# Altium schematic sheet namur_pi-dock.SchDoc
size Letter
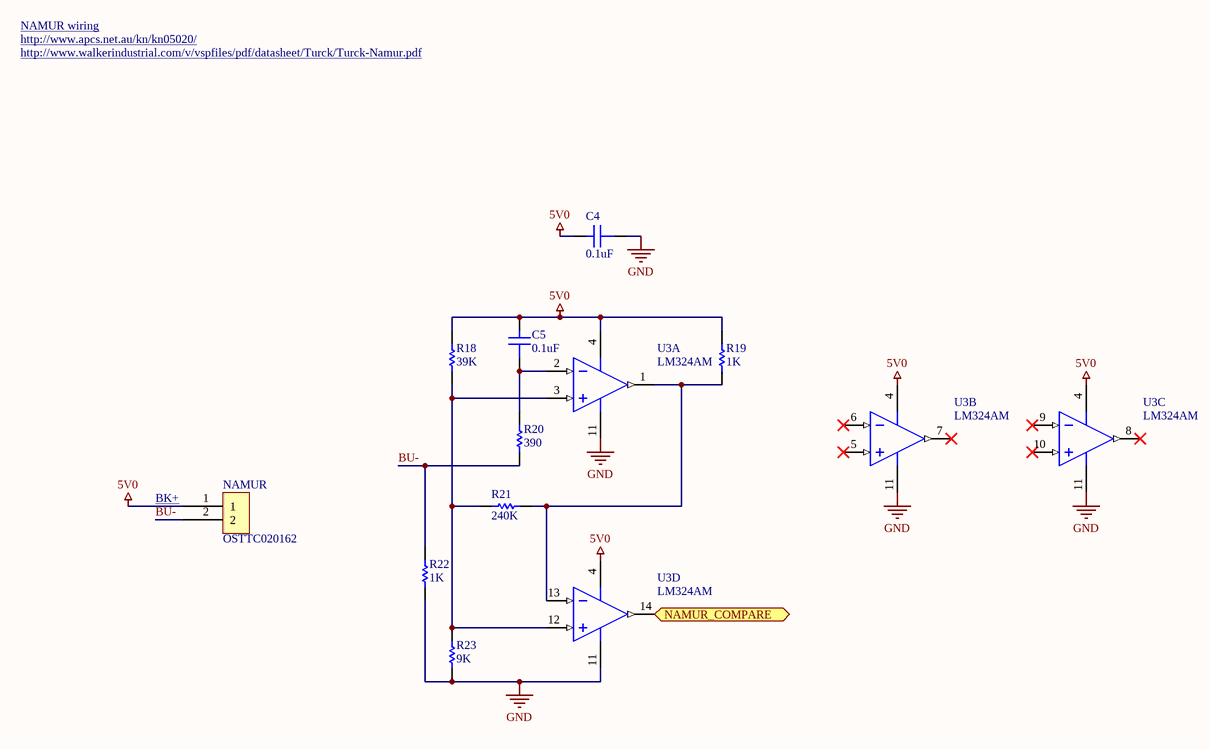
[diagram p0: namur_pi-dock.SchDoc]

## Parts
C4  0.1uF  [CAP_8085]
C5  0.1uF  [CAP_8085]
NAMUR  OSTTC020162  [DIP2_5MM_SCREWTERM]
R18  39K  [RES_8085]
R19  1K  [RES_8085]
R20  390  [RES_8085]
R21  240K  [RES_8085]
R22  1K  [RES_8085]
R23  9K  [RES_8085]
U3  LM324AM  [M14A_N]  (parts A,B,C,D of 4)

## Ports
NAMUR_COMPARE (out)

## Nets
5V0: C4.2 C5.2 NAMUR.1 R18.2 R19.2 U3.4(V+)
GND: C4.1 R22.2 R23.1 U3.11(GND)
BU-: NAMUR.2 R20.2 R22.1
NAMUR_COMPARE: U3.14(OUT4) ; port NAMUR_COMPARE
NetC5_1: C5.1 R20.1 U3.2(IN1-)
NetR18_1: R18.1 R21.1 R23.2 U3.3(IN1+) U3.12(IN4+)
NetR19_1: R19.1 R21.2 U3.1(OUT1) U3.13(IN4-)

Not connected (* = marked no-connect by the designer): U3 5(IN2+)* 6(IN2-)* 7(OUT2)* 8(OUT3)* 9(IN3-)* 10(IN3+)*

## Notes on the sheet
- NAMUR wiring
- http://www.apcs.net.au/kn/kn05020/
- http://www.walkerindustrial.com/v/vspfiles/pdf/datasheet/Turck/Turck-Namur.pdf
- (near NAMUR) BK+

## Library data of the parts
C4 C5 = CHIP-CAP: SMD Chip Capacitor; Value: 0.1uF
NAMUR = OSTTC020162: ON SHORE TERMINAL BLOCK 5MM VERT 2POS PCB; ComponentLink1URL: http://www.on-shore.com/sites/default/files/manuals/osttcxx0162.pdf; ComponentLink1Description: Datasheet; Supplier 1: Digi-Key; Supplier Part Number 1: ED2600-ND
R18-R23 = CHIP-RES: SMD Chip Resistor
  R18: Value: 39K
  R19 R22: Value: 1K
  R20: Value: 390
  R21: Value: 240K
  R23: Value: 9K
U3 = LM324AM: Low Power Quad Operational Amplifier, 14-pin Narrow SOIC; Manufacturer: National Semiconductor; PackageTopMarking: NSUZXYTTE#*LM324AM; PowerWise: N; CompType: Amplifiers; Published: 4-Dec-2008; LatestRevisionDate: 13-Jan-2009; LatestRevisionNote: Sim Model Added.; DatasheetVersion: Aug-2000; PackageVersion: revJ, Jan-1996; PackageReference: M14A; Publisher: Altium Limited; PackageDescription: Molded Package S.O., .150in Wide, 14 Lead; Supplier 1: Farnell; Supplier Part Number 1: 9486909; PartNumber: LM324AM; RoHS: N; PinCount: 14; Code_JEDEC: MS-012AB; Code_IPC: SOIC127P600-14; ComponentLink1Description: LM324 Datasheet; ComponentLink1URL: http://www.national.com/ds/LM/LM324.pdf; ComponentLink2Description: LM324 Web Page; ComponentLink2URL: http://www.national.com/pf/LM/LM324.html; ComponentLink3Description: M14A Package Page; ComponentLink3URL: http://www.national.com/packaging/folders/m14a.html